# Altium project PowerPlane.PrjPcb
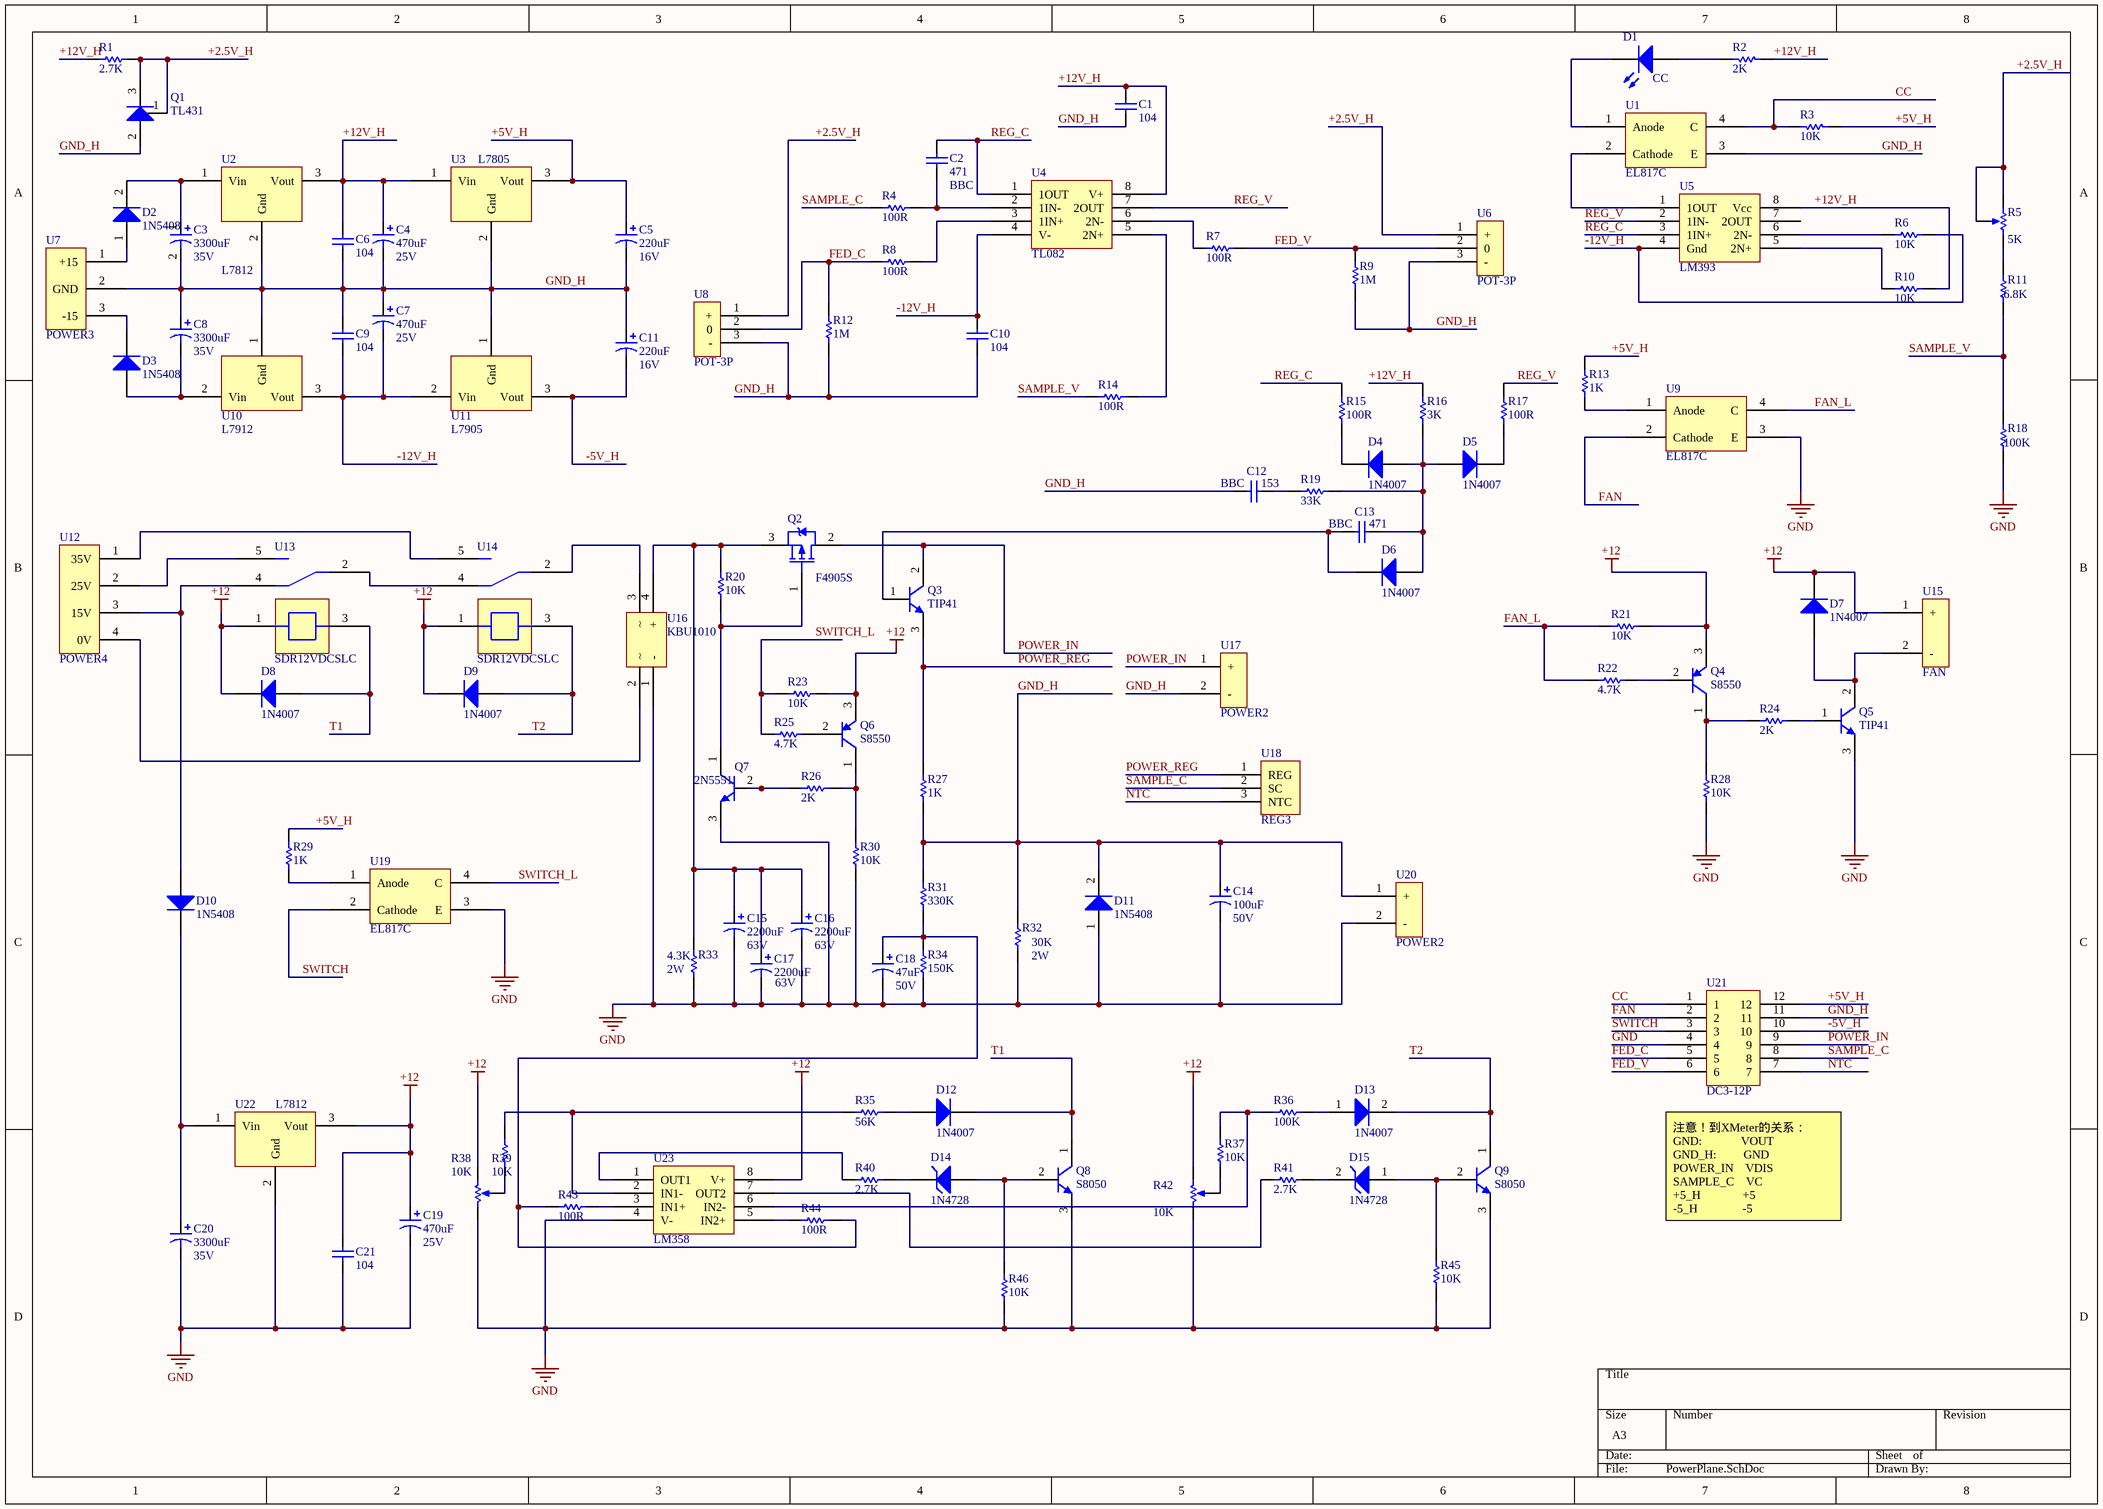
[diagram p0: PowerPlane.SchDoc]
1 sheet, 114 parts. Net scope: global (net labels, ports and power ports of the same name join across sheets).
Board file: PowerPlane.PcbDoc

## Sheet PowerPlane.SchDoc: PowerPlane
size A3; SheetNumber: 1; SheetTotal: 1; SPICEModelCacheFFDZJAYD: <root> / <DocumentId>FFDZJAYD</DocumentId> / </root>

### Parts
C1  value 104  [RAD-0.2]
C2  BBC  value 471  [RAD-0.2]
C3  35V  value 3300uF  [CAPPR7.5-16x25]
C4  25V  value 470uF  [CAPPR5-8x12]
C5  16V  value 220uF  [CAPPR5-6.3x11]
C6  value 104  [RAD-0.2]
C7  25V  value 470uF  [CAPPR5-8x12]
C8  35V  value 3300uF  [CAPPR7.5-16x25]
C9  value 104  [RAD-0.2]
C10  value 104  [RAD-0.2]
C11  16V  value 220uF  [CAPPR5-6.3x11]
C12  BBC  value 153  [RAD-0.4-BBC]
C13  BBC  value 471  [RAD-0.2]
C14  50V  value 100uF  [CAPPR5-8x12]
C15  63V  value 2200uF  [CAPPR7.5-18x35.5]
C16  63V  value 2200uF  [CAPPR7.5-18x35.5]
C17  63V  value 2200uF  [CAPPR7.5-18x35.5]
C18  50V  value 47uF  [CAPPR5-6.3x15]
C19  25V  value 470uF  [CAPPR5-8x12]
C20  35V  value 3300uF  [CAPPR7.5-16x25]
C21  value 104  [RAD-0.2]
D1  CC  [LED]
D2  1N5408  [DIO18.84-9.6x5.6-Vetical]
D3  1N5408  [DIO18.84-9.6x5.6-Vetical]
D4  1N4007  [DO-41]
D5  1N4007  [DO-41]
D6  1N4007  [DO-41]
D7  1N4007  [DO-41]
D8  1N4007  [DO-41]
D9  1N4007  [DO-41]
D10  1N5408  [DIO18.84-9.6x5.6-Vetical]
D11  1N5408  [DIO18.84-9.6x5.6-Vetical]
D12  1N4007  [DO-41]
D13  1N4007  [DO-41]
D14  1N4728  [DO-41]
D15  1N4728  [DO-41]
Q1  TL431  [TO-226-AA]
Q2  F4905S  [D2-PAK]
Q3  TIP41  [TO-220AB - HEATSINK]
Q4  S8550  [TO-92A]
Q5  TIP41  [TO-220AB]
Q6  S8550  [TO-92A]
Q7  2N5551  [TO-92A]
Q8  S8050  [TO-92A]
Q9  S8050  [TO-92A]
R1  value 2.7K  [AXIAL-0.3]
R2  value 2K  [AXIAL-0.3]
R3  value 10K  [AXIAL-0.3]
R4  value 100R  [AXIAL-0.3]
R5  value 5K  [VR5]
R6  value 10K  [AXIAL-0.3]
R7  value 100R  [AXIAL-0.3]
R8  value 100R  [AXIAL-0.3]
R9  value 1M  [AXIAL-0.3]
R10  value 10K  [AXIAL-0.3]
R11  value 6.8K  [AXIAL-0.3]
R12  value 1M  [AXIAL-0.3]
R13  value 1K  [AXIAL-0.3]
R14  value 100R  [AXIAL-0.3]
R15  value 100R  [AXIAL-0.3]
R16  value 3K  [AXIAL-0.3]
R17  value 100R  [AXIAL-0.3]
R18  value 100K  [AXIAL-0.3]
R19  value 33K  [AXIAL-0.3]
R20  value 10K  [AXIAL-0.3]
R21  value 10K  [AXIAL-0.3]
R22  value 4.7K  [AXIAL-0.3]
R23  value 10K  [AXIAL-0.3]
R24  value 2K  [AXIAL-0.3]
R25  value 4.7K  [AXIAL-0.3]
R26  value 2K  [AXIAL-0.3]
R27  value 1K  [AXIAL-0.3]
R28  value 10K  [AXIAL-0.3]
R29  value 1K  [AXIAL-0.3]
R30  value 10K  [AXIAL-0.3]
R31  value 330K  [AXIAL-0.3]
R32  2W  value 30K  [AXIAL-0.7]
R33  2W  value 4.3K  [AXIAL-0.7]
R34  value 150K  [AXIAL-0.3]
R35  value 56K  [AXIAL-0.3]
R36  value 100K  [AXIAL-0.3]
R37  value 10K  [AXIAL-0.3]
R38  value 10K  [VR5]
R39  value 10K  [AXIAL-0.3]
R40  value 2.7K  [AXIAL-0.3]
R41  value 2.7K  [AXIAL-0.3]
R42  value 10K  [VR5]
R43  value 100R  [AXIAL-0.3]
R44  value 100R  [AXIAL-0.3]
R45  value 10K  [AXIAL-0.3]
R46  value 10K  [AXIAL-0.3]
U1  EL817C  [PC817]
U2  L7812  [TO-220AB - HEATSINK]
U3  L7805  [TO-220AB - HEATSINK]
U4  TL082  [DIP-8]
U5  LM393  [DIP-8]
U6  POT-3P  [X254-3P]
U7  POWER3  [KF128-50-3P]
U8  POT-3P  [X254-3P]
U9  EL817C  [PC817]
U10  L7912  [TO-220AB - HEATSINK]
U11  L7905  [TO-220AB - HEATSINK]
U12  POWER4  [KF128-50-4P]
U13  SDR12VDCSLC  [SDR12VDCSLC]
U14  SDR12VDCSLC  [SDR12VDCSLC]
U15  FAN  [X254-2P]
U16  KBU1010  [KBU1010]
U17  POWER2  [KF128-50-2P]
U18  REG3  [X254-3P]
U19  EL817C  [PC817]
U20  POWER2  [KF128-50-2P]
U21  DC3-12P  [DC3-12P]
U22  L7812  [TO-220AB - HEATSINK]
U23  LM358  [DIP-8]

### Nets
+12: C19.1 C21.2 D7.2(K) D8.2(K) D9.2(K) Q4.3(E) Q6.3(E) R21.2 R23.2 R38.1(TOP) R42.1(TOP) U13.1(V+) U14.1(V+) U15.1(+) U22.3(Vout) U23.8(V+)
GND: C14.2 C15.2 C16.2 C17.2 C18.2 C19.2 C20.2 C21.1 D11.1(A) Q5.3(E) Q7.3(E) Q8.3(E) Q9.3(E) R18.2 R28.2 R30.2 R32.1 R33.1 R34.1 R38.2(BOT) R42.2(BOT) R45.2 R46.2 U9.3(E) U16.1(-) U19.3(E) U20.2(-) U21.4 U22.2(Gnd) U23.4(V-)
+2.5V_H: Q1.1(REF) Q1.3(K) R1.2 R5.1(TOP) R5.3(TAP) U6.1(+) U8.1(+)
+5V_H: C5.1 R3.1 R13.1 R29.1 U3.3(Vout) U21.12
+12V_H: C1.2 C4.1 C6.2 R1.1 R2.1 R10.2 R16.1 U2.3(Vout) U3.1(Vin) U4.8(V+) U5.8(Vcc)
-5V_H: C11.2 U11.3(Vout) U21.10
-12V_H: C7.2 C9.1 C10.2 R6.2 U4.4(V-) U5.4(Gnd) U10.3(Vout) U11.2(Vin)
CC: R3.2 U1.4(C) U21.1
FAN: U9.2(Cathode) U21.2
FAN_L: R21.1 R22.1 U9.4(C)
FED_C: R8.2 R12.1 U8.2(0) U21.5
FED_V: R7.1 R9.1 U6.2(0) U21.6
GND_H: C1.1 C3.2 C4.2 C5.2 C6.1 C7.1 C8.1 C9.2 C10.1 C11.1 C12.2 C14.1 D11.2(K) Q1.2(A) R9.2 R12.2 R27.1 R31.2 R32.2 U1.3(E) U2.2(Gnd) U3.2(Gnd) U6.3(-) U7.2(GND) U8.3(-) U10.1(Gnd) U11.1(Gnd) U17.2(-) U20.1(+) U21.11
NTC: U18.3(NTC) U21.7
POWER_IN: Q2.2(D) Q3.2(C) U17.1(+) U21.9
POWER_REG: Q3.3(E) R27.2 U18.1(REG)
REG_C: C2.1 R15.1 U4.1(1OUT) U5.3(1IN+)
REG_V: R17.1 U4.7(2OUT) U5.2(1IN-)
SAMPLE_C: R4.2 U18.2(SC) U21.8
SAMPLE_V: R11.2 R14.2 R18.1
SWITCH: U19.2(Cathode) U21.3
SWITCH_L: R23.1 R25.1 U19.4(C)
T1: D8.1(A) D12.2(K) Q8.1(C) U13.3(V-)
T2: D9.1(A) D13.2(K) Q9.1(C) U14.3(V-)
NetC2_2: C2.2 R4.1 U4.2(1IN-)
NetC3_1: C3.1 D2.2(K) U2.1(Vin)
NetC8_2: C8.2 D3.1(A) U10.2(Vin)
NetC12_1: C12.1 R19.2
NetC13_1: C13.1 D4.1(A) D5.1(A) D6.1(A) R16.2 R19.1
NetC13_2: C13.2 D6.2(K) Q3.1(B)
NetC15_1: C15.1 C16.1 C17.1 Q2.3(S) R20.1 R33.2 U16.4(+)
NetC18_1: C18.1 R31.1 R34.2 R43.2 R44.1
NetC20_1: C20.1 D10.2(K) U22.1(Vin)
NetD1_1: D1.1(A) R2.2
NetD1_2: D1.2(K) U1.1(Anode)
NetD2_1: D2.1(A) U7.1(+15)
NetD3_2: D3.2(K) U7.3(-15)
NetD4_2: D4.2(K) R15.2
NetD5_2: D5.2(K) R17.2
NetD7_1: D7.1(A) Q5.2(C) U15.2(-)
NetD10_1: D10.1(A) U12.3(15V) U13.4(I)
NetD12_1: D12.1(A) R35.1
NetD13_1: D13.1(A) R36.1
NetD14_1: D14.1(A) Q8.2(B) R46.1
NetD14_2: D14.2(K) R40.1
NetD15_1: D15.1(A) Q9.2(B) R45.1
NetD15_2: D15.2(K) R41.1
NetQ2_1: Q2.1(G) Q7.1(C) R20.2
NetQ4_1: Q4.1(C) R24.1 R28.1
NetQ4_2: Q4.2(B) R22.2
NetQ5_1: Q5.1(B) R24.2
NetQ6_1: Q6.1(C) R26.2 R30.1
NetQ6_2: Q6.2(B) R25.2
NetQ7_2: Q7.2(B) R26.1
NetR5_2: R5.2(BOT) R11.1
NetR6_1: R6.1 U5.6(2N-)
NetR7_2: R7.2 U4.6(2N-)
NetR8_1: R8.1 U4.3(1IN+)
NetR10_1: R10.1 U5.5(2N+)
NetR13_2: R13.2 U9.1(Anode)
NetR14_1: R14.1 U4.5(2N+)
NetR29_2: R29.2 U19.1(Anode)
NetR35_2: R35.2 R39.1 U23.2(IN1-)
NetR36_2: R36.2 R37.1 U23.6(IN2-)
NetR37_2: R37.2 R42.3(TAP)
NetR38_3: R38.3(TAP) R39.2
NetR40_2: R40.2 U23.1(OUT1)
NetR41_2: R41.2 U23.7(OUT2)
NetR43_1: R43.1 U23.3(IN1+)
NetR44_2: R44.2 U23.5(IN2+)
NetU1_2: U1.2(Cathode) U5.1(1OUT)
NetU12_1: U12.1(35V) U14.5(O)
NetU12_2: U12.2(25V) U13.5(O)
NetU12_4: U12.4(0V) U16.2
NetU13_2: U13.2(C) U14.4(I)
NetU14_2: U14.2(C) U16.3

Not connected (* = marked no-connect by the designer): U5 7(2OUT)

### Notes on the sheet
- (near U21) 注意！到XMeter的关系：
  GND:             VOUT
  GND_H:         GND
  POWER_IN    VDIS
  SAMPLE_C    VC
  +5_H              +5
  -5_H               -5

### Library data of the parts
C1 C2 C6 C9 C10 C12 C13 C21 = Cap: Capacitor; Published: 8-Jun-2000; LatestRevisionDate: 17-Jul-2002; LatestRevisionNote: Re-released for DXP Platform.; PackageReference: RAD-0.3; Publisher: Altium Limited; PackageDescription: Radial Cap, Thru-Hole; 2 Leads; 0.3 in Pin Spacing
C3-C5 C7 C8 C11 C14-C20 = Cap Pol1: Polarized Capacitor (Radial); Published: 8-Jun-2000; LatestRevisionDate: 17-Jul-2002; LatestRevisionNote: Re-released for DXP Platform.; PackageReference: RB7.6-15; Publisher: Altium Limited; PackageDescription: Polarized Capacitor (Radial); 2 Leads
D1 = LED1: Typical RED GaAs LED; Published: 8-Jun-2000; LatestRevisionDate: 08-Jul-2005; LatestRevisionNote: Mech Layer 1 removed.; PackageReference: LED-1; Publisher: Altium Limited; PackageDescription: LED; 2 Leads
D2-D13 = Diode 1N4007: 1 Amp General Purpose Rectifier; Published: 8-Jun-2000; LatestRevisionDate: 17-Jul-2002; LatestRevisionNote: Re-released for DXP Platform.; DatasheetVersion: 1998; PackageVersion: Aug-1999; PackageReference: DO-41; Publisher: Altium Limited; PackageDescription: Diode, Axial; Body 5.2 x 2.7 mm (LxDia. max), Lead Dia. 0.86 mm (max); Code_JEDEC: DO-204-AL; ComponentLink1Description: Manufacturer Link; ComponentLink1URL: http://www.fairchildsemi.com/; ComponentLink2Description: Datasheet; ComponentLink2URL: http://www.fairchildsemi.com/ds/1N%2F1N4001.pdf
D14 D15 = D Zener: Zener Diode; Published: 8-Jun-2000; LatestRevisionDate: 17-Jul-2002; LatestRevisionNote: Re-released for DXP Platform.; PackageReference: DIODE-0.7; Publisher: Altium Limited; PackageDescription: Diode, Thru-Hole; 2 Leads; 0.7 in Pin Spacing
Q2 = PMOS-2: P-Channel Power MOSFET; Note: Pin 4 not drawn and electrically connected to Pin 2.; Published: 8-Jun-2000; LatestRevisionDate: 17-Jul-2002; LatestRevisionNote: Re-released for DXP Platform.; DatasheetVersion: PD-9.390D; PackageVersion: Feb-1997; PackageReference: TO-220AB; Publisher: Altium Limited; PackageDescription: TO, Thru-Hole, Vertical, Heatsink Mounted; 3 In-Line Leads; Pitch 2.54 mm; ComponentLink1Description: Manufacturer Link; ComponentLink1URL: http://www.irf.com/
Q3 Q5 Q7-Q9 = NPN: NPN Bipolar Transistor; Published: 8-Jun-2000; LatestRevisionDate: 17-Jul-2002; LatestRevisionNote: Re-released for DXP Platform.; PackageReference: TO-226-AA; Publisher: Altium Limited; PackageDescription: TO, Flat Index; 3 In-Line, Axial Leads; Body Dia. 4.8mm; Leads 0.55 x 0.51 mm (max); Code_JEDEC: TO-226-AA
Q4 Q6 = PNP: PNP Bipolar Transistor; Published: 8-Jun-2000; LatestRevisionDate: 29-May-2009; LatestRevisionNote: IPC-7351 Footprint Added.; PackageVersion: Aug-1999; PackageReference: SOT-23B; Publisher: Altium Limited; PackageDescription: 3-Pin SOT-23 Package 0.95 mm Pitch, 2.4 mm Lead Span
R1-R4 R6-R37 R39-R41 R43-R46 = Res1: Resistor; Published: 8-Jun-2000; LatestRevisionDate: 17-Jul-2002; LatestRevisionNote: Re-released for DXP Platform.; PackageReference: AXIAL-0.3; Publisher: Altium Limited; PackageDescription: Axial Device, Thru-Hole; 2 Leads; 0.3 in Pin Spacing
R5 R38 R42 = RPot: Potentiometer; Sim Note: Enter the Resistance value and the set point into parameter fields.; Set Position: 0.5; Published: 8-Jun-2000; LatestRevisionDate: 17-Jul-2002; LatestRevisionNote: Re-released for DXP Platform.; PackageReference: VR5; Publisher: Altium Limited; PackageDescription: Variable Resistor, Thru-Hole; 3 Leads
U7 = POWER3: Power Connector 3
U12 = POWER4: Power Connector 3
U18 = REG3: REG2